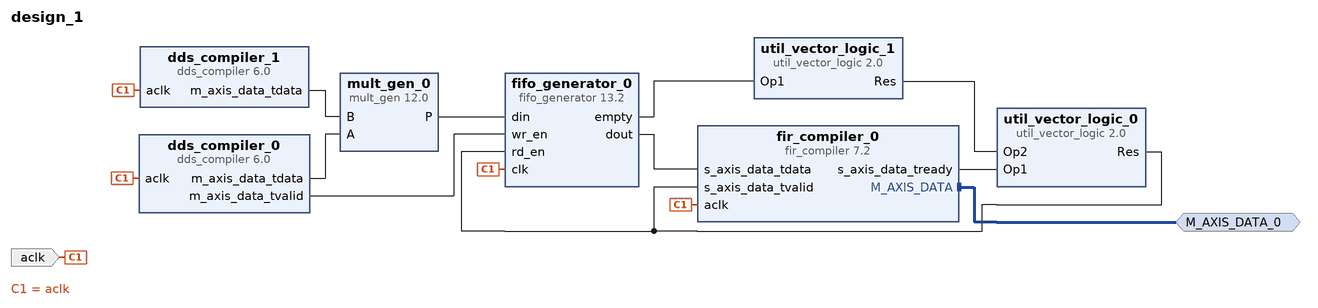
[diagram p0: block diagram of the top level]
# Vivado block design design_1, xc7z020clg484-1, Vivado 2023.1
create_bd_design design_1

create_bd_intf_port -mode Master -vlnv xilinx.com:interface:axis_rtl:1.0 M_AXIS_DATA_0
create_bd_port -dir I -type clk aclk

create_bd_cell -type ip -vlnv xilinx.com:ip:dds_compiler:6.0 dds_compiler_0
set_property -dict [list \
  CONFIG.Has_Phase_Out false \
  CONFIG.M_DATA_Has_TUSER Not_Required \
  CONFIG.Output_Frequency1 0.001 \
  CONFIG.Output_Selection Sine \
  CONFIG.PINC1 101001111100 \
] [get_bd_cells dds_compiler_0]
create_bd_cell -type ip -vlnv xilinx.com:ip:dds_compiler:6.0 dds_compiler_1
set_property -dict [list \
  CONFIG.Has_Phase_Out false \
  CONFIG.M_DATA_Has_TUSER Not_Required \
  CONFIG.Output_Frequency1 0.005 \
  CONFIG.Output_Selection Sine \
  CONFIG.PINC1 11010001101101 \
] [get_bd_cells dds_compiler_1]
create_bd_cell -type ip -vlnv xilinx.com:ip:mult_gen:12.0 mult_gen_0
set_property -dict [list \
  CONFIG.PipeStages 0 \
  CONFIG.PortAType Signed \
  CONFIG.PortAWidth 8 \
  CONFIG.PortBType Signed \
  CONFIG.PortBWidth 8 \
] [get_bd_cells mult_gen_0]
create_bd_cell -type ip -vlnv xilinx.com:ip:util_vector_logic:2.0 util_vector_logic_0
set_property -dict {CONFIG.C_SIZE 1} [get_bd_cells util_vector_logic_0]
create_bd_cell -type ip -vlnv xilinx.com:ip:util_vector_logic:2.0 util_vector_logic_1
set_property -dict {CONFIG.C_OPERATION not CONFIG.C_SIZE 1} [get_bd_cells util_vector_logic_1]
create_bd_cell -type ip -vlnv xilinx.com:ip:fir_compiler:7.2 fir_compiler_0
set_property -dict [list \
  CONFIG.Clock_Frequency 100.0 \
  CONFIG.CoefficientVector {['-1.0000e-04, 0, 2.0000e-04, 7.0000e-04, 1.4000e-03, 2.4000e-03, 3.7000e-03, 5.0000e-03, 6.2000e-03, 7.0000e-03, 7.2000e-03, 6.4000e-03, 4.8000e-03, 2.4000e-03, -5.0000e-04, -3.2000e-03, -5.2000e-03,', '-6.1000e-03, -5.4000e-03, -3.3000e-03, -1.0000e-04, 3.4000e-03, 6.4000e-03, 8.0000e-03, 7.7000e-03, 5.1000e-03, 8.0000e-04, -4.3000e-03, -8.9000e-03, -1.1700e-02, -1.1600e-02, -8.2000e-03,', '-2.0000e-03, 5.7000e-03, 1.3100e-02, 1.7900e-02, 1.8500e-02, 1.3800e-02, 4.3000e-03, -8.4000e-03, -2.1500e-02, -3.1300e-02, -3.4300e-02, -2.7800e-02, -1.0600e-02, 1.6500e-02, 5.0800e-02, 8.7800e-02,', '1.2210e-01, 1.4860e-01, 1.6300e-01, 1.6300e-01, 1.4860e-01, 1.2210e-01, 8.7800e-02, 5.0800e-02, 1.6500e-02, -1.0600e-02, -2.7800e-02, -3.4300e-02, -3.1300e-02, -2.1500e-02, -8.4000e-03, 4.3000e-03,', '1.3800e-02, 1.8500e-02, 1.7900e-02, 1.3100e-02, 5.7000e-03, -2.0000e-03, -8.2000e-03, -1.1600e-02, -1.1700e-02, -8.9000e-03, -4.3000e-03, 8.0000e-04, 5.1000e-03, 7.7000e-03, 8.0000e-03, 6.4000e-03,', '3.4000e-03, -1.0000e-04, -3.3000e-03, -5.4000e-03, -6.1000e-03, -5.2000e-03, -3.2000e-03, -5.0000e-04, 2.4000e-03, 4.8000e-03, 6.4000e-03, 7.2000e-03, 7.0000e-03, 6.2000e-03, 5.0000e-03, 3.7000e-03,', '2.4000e-03, 1.4000e-03, 7.0000e-04, 2.0000e-04, 0.0000e+00, -1.0000e-04']} \
  CONFIG.Coefficient_Fractional_Bits 17 \
  CONFIG.Coefficient_Sets 1 \
  CONFIG.Coefficient_Sign Signed \
  CONFIG.Coefficient_Structure Inferred \
  CONFIG.Coefficient_Width 16 \
  CONFIG.Data_Fractional_Bits 0 \
  CONFIG.Data_Sign Signed \
  CONFIG.Data_Width 16 \
  CONFIG.Filter_Architecture Systolic_Multiply_Accumulate \
  CONFIG.Output_Width 34 \
  CONFIG.Quantization Quantize_Only \
  CONFIG.Sample_Frequency 0.008 \
] [get_bd_cells fir_compiler_0]
create_bd_cell -type ip -vlnv xilinx.com:ip:fifo_generator:13.2 fifo_generator_0
set_property -dict {CONFIG.Input_Data_Width 16 CONFIG.Reset_Pin false} [get_bd_cells fifo_generator_0]

# ---- connections ----

connect_bd_intf_net [get_bd_intf_ports M_AXIS_DATA_0] [get_bd_intf_pins fir_compiler_0/M_AXIS_DATA]
connect_bd_net [get_bd_pins util_vector_logic_0/Res] [get_bd_pins fifo_generator_0/rd_en] [get_bd_pins fir_compiler_0/s_axis_data_tvalid]
connect_bd_net -net aclk_0_1 [get_bd_ports aclk] \
  [get_bd_pins dds_compiler_0/aclk] [get_bd_pins dds_compiler_1/aclk] [get_bd_pins fir_compiler_0/aclk] \
  [get_bd_pins fifo_generator_0/clk]
connect_bd_net [get_bd_pins dds_compiler_0/m_axis_data_tdata] [get_bd_pins mult_gen_0/A]
connect_bd_net [get_bd_pins dds_compiler_0/m_axis_data_tvalid] [get_bd_pins fifo_generator_0/wr_en]
connect_bd_net [get_bd_pins dds_compiler_1/m_axis_data_tdata] [get_bd_pins mult_gen_0/B]
connect_bd_net [get_bd_pins fifo_generator_0/dout] [get_bd_pins fir_compiler_0/s_axis_data_tdata]
connect_bd_net [get_bd_pins fifo_generator_0/empty] [get_bd_pins util_vector_logic_1/Op1]
connect_bd_net [get_bd_pins fir_compiler_0/s_axis_data_tready] [get_bd_pins util_vector_logic_0/Op1]
connect_bd_net [get_bd_pins mult_gen_0/P] [get_bd_pins fifo_generator_0/din]
connect_bd_net [get_bd_pins util_vector_logic_1/Res] [get_bd_pins util_vector_logic_0/Op2]

validate_bd_design
save_bd_design
